# Altium project uRF.PrjPcb
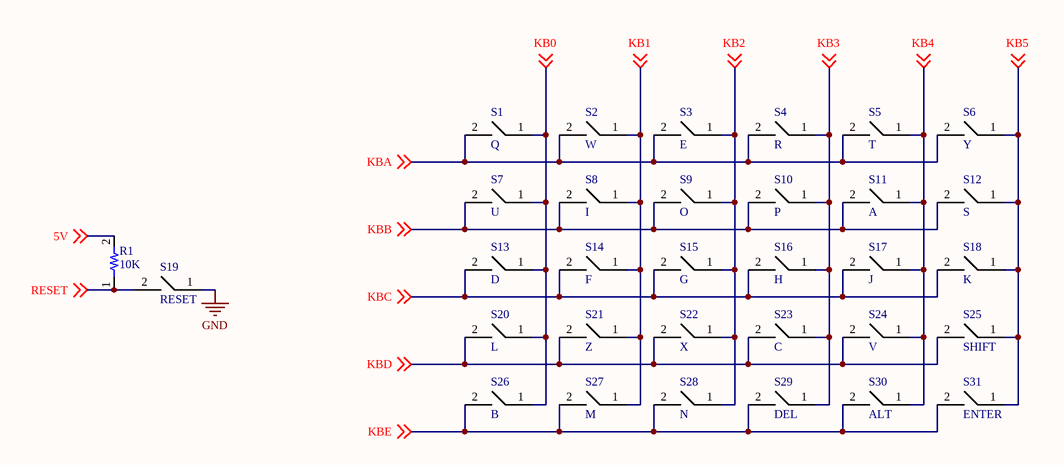
[diagram p0: Buton.SchDoc]
3 sheets, 76 parts. Net scope: global (net labels, ports and power ports of the same name join across sheets).
Board file: PCB.PcbDoc
Sheets:
  Buton.SchDoc
  MCU.SchDoc
  Guc.SchDoc

## Sheet Buton.SchDoc
size A4

### Parts
R1  10K  [0603 Resistor]
S1  Q  [TACT SWITCH SMD]
S2  W  [TACT SWITCH SMD]
S3  E  [TACT SWITCH SMD]
S4  R  [TACT SWITCH SMD]
S5  T  [TACT SWITCH SMD]
S6  Y  [TACT SWITCH SMD]
S7  U  [TACT SWITCH SMD]
S8  I  [TACT SWITCH SMD]
S9  O  [TACT SWITCH SMD]
S10  P  [TACT SWITCH SMD]
S11  A  [TACT SWITCH SMD]
S12  S  [TACT SWITCH SMD]
S13  D  [TACT SWITCH SMD]
S14  F  [TACT SWITCH SMD]
S15  G  [TACT SWITCH SMD]
S16  H  [TACT SWITCH SMD]
S17  J  [TACT SWITCH SMD]
S18  K  [TACT SWITCH SMD]
S19  RESET  [TACT SWITCH SMD]
S20  L  [TACT SWITCH SMD]
S21  Z  [TACT SWITCH SMD]
S22  X  [TACT SWITCH SMD]
S23  C  [TACT SWITCH SMD]
S24  V  [TACT SWITCH SMD]
S25  SHIFT  [TACT SWITCH SMD]
S26  B  [TACT SWITCH SMD]
S27  M  [TACT SWITCH SMD]
S28  N  [TACT SWITCH SMD]
S29  DEL  [TACT SWITCH SMD]
S30  ALT  [TACT SWITCH SMD]
S31  ENTER  [TACT SWITCH SMD]

### Nets
GND: S19.1
5V: R1.2 ; off-sheet 5V
KB0: S1.1 S7.1 S13.1 S20.1 S26.1 ; off-sheet KB0
KB1: S2.1 S8.1 S14.1 S21.1 S27.1 ; off-sheet KB1
KB2: S3.1 S9.1 S15.1 S22.1 S28.1 ; off-sheet KB2
KB3: S4.1 S10.1 S16.1 S23.1 S29.1 ; off-sheet KB3
KB4: S5.1 S11.1 S17.1 S24.1 S30.1 ; off-sheet KB4
KB5: S6.1 S12.1 S18.1 S25.1 S31.1 ; off-sheet KB5
KBA: S1.2 S2.2 S3.2 S4.2 S5.2 S6.2 ; off-sheet KBA
KBB: S7.2 S8.2 S9.2 S10.2 S11.2 S12.2 ; off-sheet KBB
KBC: S13.2 S14.2 S15.2 S16.2 S17.2 S18.2 ; off-sheet KBC
KBD: S20.2 S21.2 S22.2 S23.2 S24.2 S25.2 ; off-sheet KBD
KBE: S26.2 S27.2 S28.2 S29.2 S30.2 S31.2 ; off-sheet KBE
RESET: R1.1 S19.2 ; off-sheet RESET

### Library data of the parts
R1 = 0603 Resistor: Resistor; Manufacturer_Name: TE Connectivity; Manufacturer_Part_Number: CPF0603B100RE1; Datasheet Link: http://www.farnell.com/datasheets/1786775.pdf; Height: 0.55mm; Mouser Part Number: 279-CPF0603B100RE1; Mouser Price/Stock: https://www.mouser.co.uk/ProductDetail/TE-Connectivity-Neohm/CPF0603B100RE1?qs=DfH2yQaBz6s2KWheq2AlNw%3D%3D; Arrow Part Number: CPF0603B100RE1; Arrow Price/Stock: https://www.arrow.com/en/products/cpf0603b100re1/te-connectivity
S1-S31 = TACT SWITCH SMD: MP: B3F-1000; MF: Omron; Price: None; Package: None; Value: *; Availability: Unavailable; SnapEDA_Link: https://www.snapeda.com/parts/B3F-1000/Omron%20Electronics%20Inc-EMC%20Div/view-part/48569/?ref=snap

## Sheet MCU.SchDoc
size A4
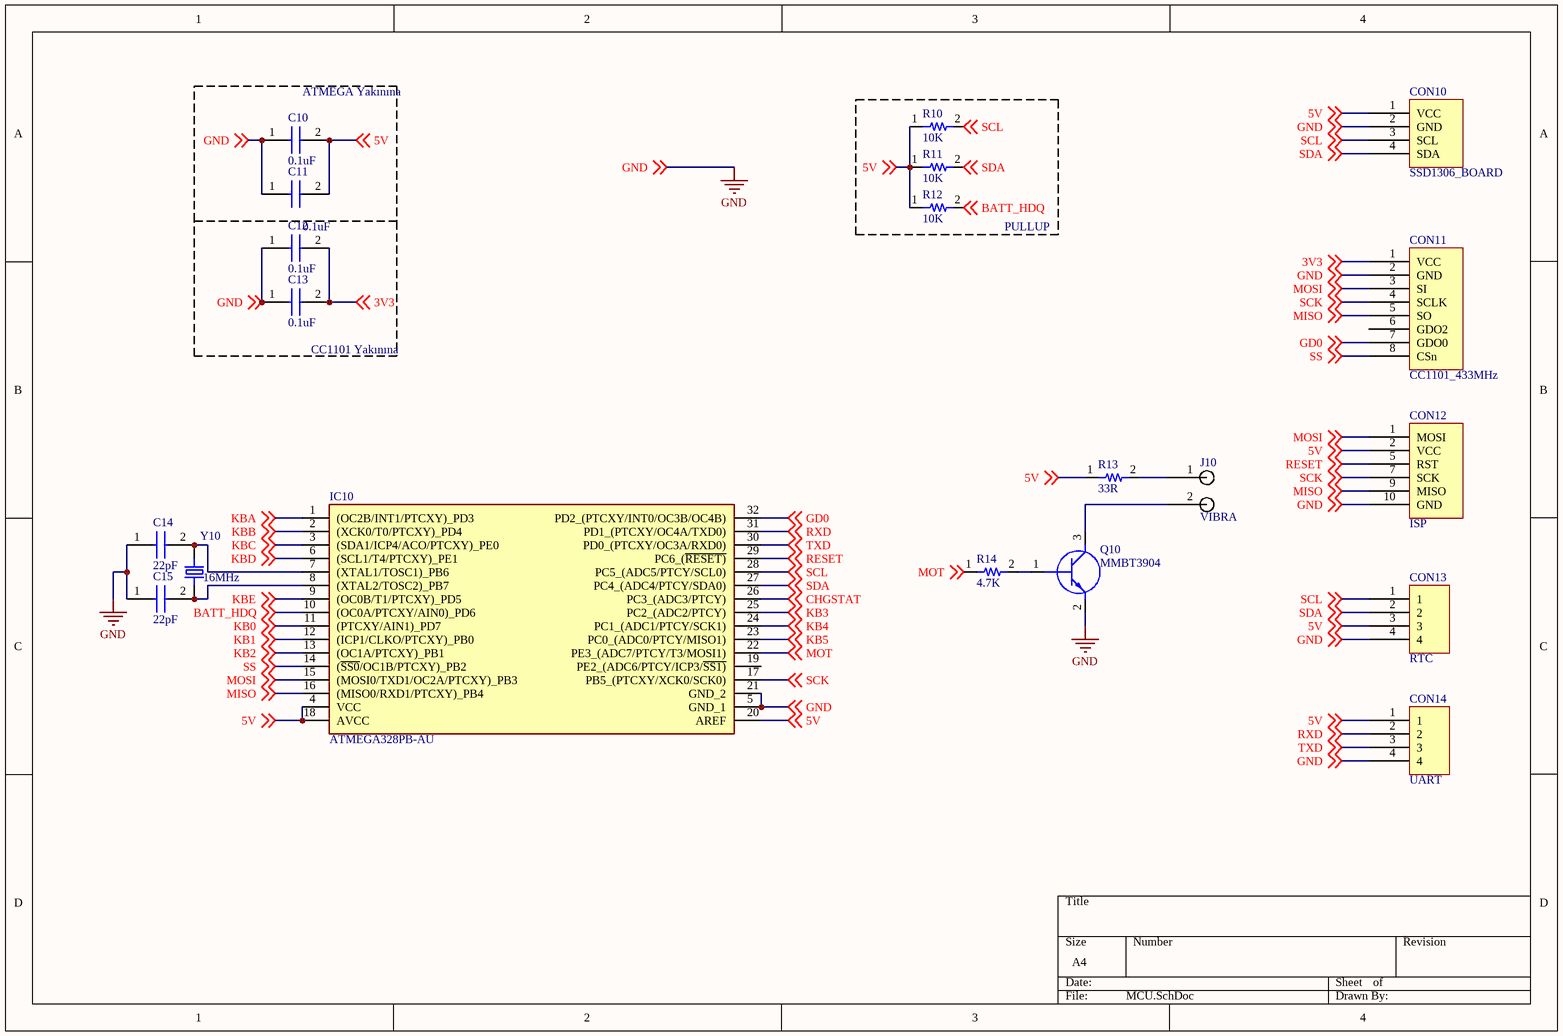
[diagram p1: MCU.SchDoc]

### Parts
C10  0.1uF  [0603 Capacitor]
C11  0.1uF  [0603 Capacitor]
C12  0.1uF  [0603 Capacitor]
C13  0.1uF  [0603 Capacitor]
C14  22pF  [0603 Capacitor]
C15  22pF  [0603 Capacitor]
CON10  SSD1306_BOARD  [SSD1306_PCB]
CON11  CC1101_433MHz  [CC1101_433MHz]
CON12  ISP  [ISP]
CON13  RTC  [JumperHDR4]
CON14  UART  [JumperHDR4]
IC10  ATMEGA328PB-AU  [328PB-AU]
J10  VIBRA  [JumperHDR]
Q10  MMBT3904  [SOT95P240X120-3N]
R10  10K  [0603 Resistor]
R11  10K  [0603 Resistor]
R12  10K  [0603 Resistor]
R13  33R  [0603 Resistor]
R14  4.7K  [0603 Resistor]
Y10  value 16MHz  [Crystal-HC49]

### Blocks framed on the sheet
ATMEGA Yakınına: C10 C11
PULLUP: R10-R12
CC1101 Yakınına: C12 C13

### Nets
GND: C10.1 C11.1 C12.1 C13.1 C14.1 C15.1 CON10.2(GND) CON11.2(GND) CON12.10(GND) CON13.4 CON14.4 IC10.5(GND_1) IC10.21(GND_2) Q10.2(E) ; off-sheet GND
3V3: C12.2 C13.2 CON11.1(VCC) ; off-sheet 3V3
5V: C10.2 C11.2 CON10.1(VCC) CON12.2(VCC) CON13.3 CON14.1 IC10.4(VCC) IC10.18(AVCC) IC10.20(AREF) R10.1 R11.1 R12.1 R13.1 ; off-sheet 5V
BATT_HDQ: IC10.10((OC0A/PTCXY/AIN0)_PD6) R12.2 ; off-sheet BATT_HDQ
CHGSTAT: IC10.26(PC3_(ADC3/PTCY)) ; off-sheet CHGSTAT
GD0: CON11.7(GDO0) IC10.32(PD2_(PTCXY/INT0/OC3B/OC4B)) ; off-sheet GD0
KB0: IC10.11((PTCXY/AIN1)_PD7) ; off-sheet KB0
KB1: IC10.12((ICP1/CLKO/PTCXY)_PB0) ; off-sheet KB1
KB2: IC10.13((OC1A/PTCXY)_PB1) ; off-sheet KB2
KB3: IC10.25(PC2_(ADC2/PTCY)) ; off-sheet KB3
KB4: IC10.24(PC1_(ADC1/PTCY/SCK1)) ; off-sheet KB4
KB5: IC10.23(PC0_(ADC0/PTCY/MISO1)) ; off-sheet KB5
KBA: IC10.1((OC2B/INT1/PTCXY)_PD3) ; off-sheet KBA
KBB: IC10.2((XCK0/T0/PTCXY)_PD4) ; off-sheet KBB
KBC: IC10.3((SDA1/ICP4/ACO/PTCXY)_PE0) ; off-sheet KBC
KBD: IC10.6((SCL1/T4/PTCXY)_PE1) ; off-sheet KBD
KBE: IC10.9((OC0B/T1/PTCXY)_PD5) ; off-sheet KBE
MISO: CON11.5(SO) CON12.9(MISO) IC10.16((MISO0/RXD1/PTCXY)_PB4) ; off-sheet MISO
MOSI: CON11.3(SI) CON12.1(MOSI) IC10.15((MOSI0/TXD1/OC2A/PTCXY)_PB3) ; off-sheet MOSI
MOT: IC10.22(PE3_(ADC7/PTCY/T3/MOSI1)) R14.1 ; off-sheet MOT
RESET: CON12.5(RST) IC10.29(PC6_(~{RESET)}) ; off-sheet RESET
RXD: CON14.2 IC10.31(PD1_(PTCXY/OC4A/TXD0)) ; off-sheet RXD
SCK: CON11.4(SCLK) CON12.7(SCK) IC10.17(PB5_(PTCXY/XCK0/SCK0)) ; off-sheet SCK
SCL: CON10.3(SCL) CON13.1 IC10.28(PC5_(ADC5/PTCY/SCL0)) R10.2 ; off-sheet SCL
SDA: CON10.4(SDA) CON13.2 IC10.27(PC4_(ADC4/PTCY/SDA0)) R11.2 ; off-sheet SDA
SS: CON11.8(CSn) IC10.14((~{SS0}/OC1B/PTCXY)_PB2) ; off-sheet SS
TXD: CON14.3 IC10.30(PD0_(PTCXY/OC3A/RXD0)) ; off-sheet TXD
NetC14_2: C14.2 IC10.7((XTAL1/TOSC1)_PB6) Y10.2
NetC15_2: C15.2 IC10.8((XTAL2/TOSC2)_PB7) Y10.1
NetJ10_1: J10.1 R13.2
NetJ10_2: J10.2 Q10.3(C)
NetQ10_1: Q10.1(B) R14.2

Not connected (* = marked no-connect by the designer): CON11 6(GDO2); IC10 19(PE2_(ADC6/PTCY/ICP3/~{SS1)})

### Library data of the parts
C10-C15 = 0603 Capacitor: Capacitor; Manufacturer_Name: AVX; Manufacturer_Part_Number: 06031A120JAT2A; Datasheet Link: http://www.mouser.com/catalog/supplier/library/pdf/AVXSurfaceMountCeramic.pdf; Height: 0.9mm; Mouser Part Number: 581-06031A120J; Mouser Price/Stock: https://www.mouser.co.uk/ProductDetail/AVX/06031A120JAT2A?qs=tMrmimOZp5UsY%252BxF6dNGxQ%3D%3D; Arrow Part Number: 06031A120JAT2A; Arrow Price/Stock: https://www.arrow.com/en/products/06031a120jat2a/avx
CON12 = ISP: pin to pad: 10>4
CON13 CON14 = JumperHDR4
IC10 = ATMEGA328PB-AU: Integrated Circuit; Manufacturer_Name: Microchip; Datasheet Link: http://www.farnell.com/datasheets/2014286.pdf; Height: 1.2mm; Manufacturer_Part_Number: ATMEGA328PB-AU; Mouser Part Number: 556-ATMEGA328PB-AU; Mouser Price/Stock: https://www.mouser.co.uk/ProductDetail/Microchip-Technology-Atmel/ATMEGA328PB-AU?qs=jy4bLUHv09hbFONgGrqPbw%3D%3D; Arrow Part Number: ATMEGA328PB-AU; Arrow Price/Stock: https://www.arrow.com/en/products/atmega328pb-au/microchip-technology
J10 = JumperHDR_ALT
Q10 = MMBT3904: Transistor BJT NPN; Manufacturer_Name: ON Semiconductor; Datasheet Link: https://media.digikey.com/pdf/Data%20Sheets/ON%20Semiconductor%20PDFs/2N3904,MMBT3904,PZT3904.pdf; Height: 1.2mm; Manufacturer_Part_Number: MMBT3904; Mouser Part Number: 512-MMBT3904; Mouser Price/Stock: https://www.mouser.co.uk/ProductDetail/ON-Semiconductor-Fairchild/MMBT3904?qs=UMEuL5FsraCg3xKjS4uBJQ%3D%3D; Arrow Part Number: MMBT3904; Arrow Price/Stock: https://www.arrow.com/en/products/mmbt3904/on-semiconductor
R10-R14 = 0603 Resistor: as R1 on sheet Buton; Datasheet Link: http://www.farnell.com/datasheets/1786775.pdf; Height: 0.55mm; Mouser Part Number: 279-CPF0603B100RE1; Mouser Price/Stock: https://www.mouser.co.uk/ProductDetail/TE-Connectivity-Neohm/CPF0603B100RE1?qs=DfH2yQaBz6s2KWheq2AlNw%3D%3D; Arrow Part Number: CPF0603B100RE1; Arrow Price/Stock: https://www.arrow.com/en/products/cpf0603b100re1/te-connectivity
Y10 = HC49 Crystal: MF: ECS Inc.; MP: ECS-80-18-4XDN; Digi-Key_Part_Number: X1115-ND; Package: HC-49/US ECS International; SnapEDA_Link: https://www.snapeda.com/parts/ECS-80-18-4XDN/ECS%20Inc./view-part/49558/?ref=snap; Digi-Key_Purchase_URL: https://www.digikey.in/product-detail/en/ecs-inc/ECS-80-18-4XDN/X1115-ND/827606?utm_source=snapeda&utm_medium=aggregator&utm_campaign=symbol

## Sheet Guc.SchDoc
size A4
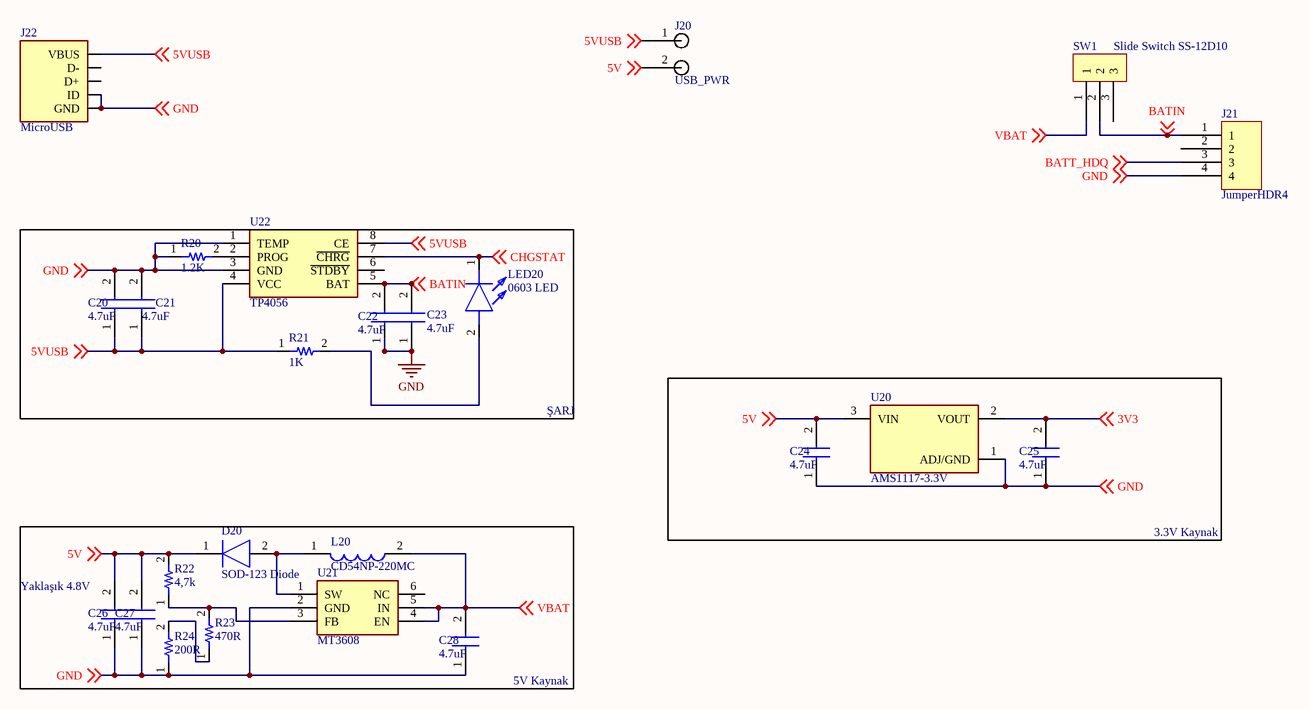
[diagram p2: Guc.SchDoc]

### Parts
C20  4.7uF  [0603 Capacitor]
C21  4.7uF  [0603 Capacitor]
C22  4.7uF  [0603 Capacitor]
C23  4.7uF  [0603 Capacitor]
C24  4.7uF  [0603 Capacitor]
C25  4.7uF  [0603 Capacitor]
C26  4.7uF  [0603 Capacitor]
C27  4.7uF  [0603 Capacitor]
C28  4.7uF  [0603 Capacitor]
D20  SOD-123 Diode  [SOD123]
J20  USB_PWR  [JumperHDR]
J21  JumperHDR4  [JumperHDR4]
J22  MicroUSB  [MicroUSB]
L20  CD54NP-220MC  [CD54NP220MC]
LED20  0603 LED  [0603 LED]
R20  1.2K  [0603 Resistor]
R21  1K  [0603 Resistor]
R22  4,7k  [0603 Resistor]
R23  470R  [0603 Resistor]
R24  200R  [0603 Resistor]
SW1  Slide Switch SS-12D10  [Slide Switch ss12d10]
U20  AMS1117-3.3V  [AMS1117_SOT223]
U21  MT3608  [MT3608]
U22  TP4056  [TP4056A]

### Blocks framed on the sheet
ŞARJ: C20-C23 LED20 R20 R21 U22
3.3V Kaynak: C24 C25 U20

### Nets
GND: C20.2 C21.2 C22.1 C23.1 C24.1 C25.1 C26.1 C27.1 C28.1 J21.4 J22.4(ID) J22.5(GND) R20.1 R24.1 U20.1(ADJ/GND) U21.2(GND) U22.1(TEMP) U22.3(GND) ; off-sheet GND
3V3: C25.2 U20.2(VOUT) ; off-sheet 3V3
5V: C24.2 C26.2 C27.2 D20.1(K) J20.2 R22.2 U20.3(VIN) ; off-sheet 5V
5VUSB: C20.1 C21.1 J20.1 J22.1(VBUS) R21.1 U22.4(VCC) U22.8(CE) ; off-sheet 5VUSB
BATIN: C22.2 C23.2 J21.1 SW1.2 U22.5(BAT) ; off-sheet BATIN
BATT_HDQ: J21.3 ; off-sheet BATT_HDQ
CHGSTAT: LED20.1(K) U22.7(~{CHRG}) ; off-sheet CHGSTAT
VBAT: C28.2 L20.2 SW1.1 U21.4(EN) U21.5(IN) ; off-sheet VBAT
NetD20_2: D20.2(A) L20.1 U21.1(SW)
NetLED20_2: LED20.2(A) R21.2
NetR20_2: R20.2 U22.2(PROG)
NetR22_1: R22.1 R23.2 U21.3(FB)
NetR23_1: R23.1 R24.2

Not connected (* = marked no-connect by the designer): J21 2; J22 2(D-) 3(D+); SW1 3; U21 6(NC); U22 6(~{STDBY})

### Notes on the sheet
- (near C26) Yaklaşık 4.8V
- 5V Kaynak

### Library data of the parts
C20-C28 = 0603 Capacitor: as C10 on sheet MCU; Datasheet Link: http://www.mouser.com/catalog/supplier/library/pdf/AVXSurfaceMountCeramic.pdf; Height: 0.9mm; Mouser Part Number: 581-06031A120J; Mouser Price/Stock: https://www.mouser.co.uk/ProductDetail/AVX/06031A120JAT2A?qs=tMrmimOZp5UsY%252BxF6dNGxQ%3D%3D; Arrow Part Number: 06031A120JAT2A; Arrow Price/Stock: https://www.arrow.com/en/products/06031a120jat2a/avx
D20 = SOD-123 Diode: Diode; Manufacturer_Name: Vishay; Manufacturer_Part_Number: 1N4148W-G3-08; Datasheet Link: https://componentsearchengine.com/Datasheets/1/1N4148W-G3-08.pdf; Height: 1.35mm; Mouser Part Number: 78-1N4148W-G3-08; Mouser Price/Stock: https://www.mouser.co.uk/ProductDetail/Vishay-Semiconductors/1N4148W-G3-08?qs=uS%252BVSIFnvp46StDBB15x4Q%3D%3D; Arrow Part Number: 1N4148W-G3-08; Arrow Price/Stock: https://www.arrow.com/en/products/1n4148w-g3-08/vishay
J20 = JumperHDR_ALT
J22 = MicroUSB: MP: ZX62-B-5PA; MF: Hirose; Value: *; Price: None; SnapEDA_Link: https://www.snapeda.com/parts/ZX62-B-5PA/Hirose%20Electric%20Co%20Ltd/view-part/134668/?ref=snap; Availability: Unavailable; Package: None
L20 = CD54NP-220MC: Inductor; Manufacturer_Name: Sumida; Datasheet Link: https://www.mouser.com/datasheet/2/390/CD54-465574.pdf; Height: 4.85mm; Manufacturer_Part_Number: CD54NP-220MC; Mouser Part Number: 851-CD54NP-220MC; Mouser Price/Stock: https://www.mouser.co.uk/ProductDetail/Sumida/CD54NP-220MC?qs=ttApTud31JaKcWkDFuIZsQ%3D%3D; Arrow Part Number: CD54NP-220MC; Arrow Price/Stock: https://www.arrow.com/en/products/cd54np-220mc/sumida
LED20 = 0603 LED: LED; Manufacturer_Name: Wurth Elektronik; Manufacturer_Part_Number: 150060GS55040; Datasheet Link: https://katalog.we-online.de/led/datasheet/150060GS55040.pdf; Height: 0.5mm; Mouser Part Number: 710-150060GS55040; Mouser Price/Stock: https://www.mouser.com/Search/Refine.aspx?Keyword=710-150060GS55040
R20-R24 = 0603 Resistor: as R1 on sheet Buton; Datasheet Link: http://www.farnell.com/datasheets/1786775.pdf; Height: 0.55mm; Mouser Part Number: 279-CPF0603B100RE1; Mouser Price/Stock: https://www.mouser.co.uk/ProductDetail/TE-Connectivity-Neohm/CPF0603B100RE1?qs=DfH2yQaBz6s2KWheq2AlNw%3D%3D; Arrow Part Number: CPF0603B100RE1; Arrow Price/Stock: https://www.arrow.com/en/products/cpf0603b100re1/te-connectivity
U20 = AMS1117: MF: Seeed Technology; Availability: Unavailable; SnapEDA_Link: https://www.snapeda.com/parts/AMS1117/Seeed%20Technology%20Co.%2C%20Ltd/view-part/184428/?ref=snap; MP: AMS1117; Price: None; Value: *; Package: SOT-223 Seeed Technology
U21 = MT3608: Undefined or Miscellaneous; Manufacturer_Name: Aerosemi; Datasheet Link: https://www.olimex.com/Products/Breadboarding/BB-PWR-3608/resources/MT3608.pdf; Height: 1.45mm; Manufacturer_Part_Number: MT3608
U22 = TP4056: Connector; Manufacturer_Name: NanJing Top Power; Datasheet Link: https://dlnmh9ip6v2uc.cloudfront.net/datasheets/Prototyping/TP4056.pdf; Height: 1.75mm; Manufacturer_Part_Number: TP4056

## Nets that join several sheets
GND: Buton (S19.1), MCU (14 pins), Guc (18 pins)
3V3: MCU (C12.2 C13.2 CON11.1), Guc (C25.2 U20.2)
5V: Buton (R1.2), MCU (13 pins), Guc (7 pins)
BATT_HDQ: MCU (IC10.10 R12.2), Guc (J21.3)
CHGSTAT: MCU (IC10.26), Guc (LED20.1 U22.7)
KB0: Buton (5 pins), MCU (IC10.11)
KB1: Buton (5 pins), MCU (IC10.12)
KB2: Buton (5 pins), MCU (IC10.13)
KB3: Buton (5 pins), MCU (IC10.25)
KB4: Buton (5 pins), MCU (IC10.24)
KB5: Buton (5 pins), MCU (IC10.23)
KBA: Buton (6 pins), MCU (IC10.1)
KBB: Buton (6 pins), MCU (IC10.2)
KBC: Buton (6 pins), MCU (IC10.3)
KBD: Buton (6 pins), MCU (IC10.6)
KBE: Buton (6 pins), MCU (IC10.9)
RESET: Buton (R1.1 S19.2), MCU (CON12.5 IC10.29)